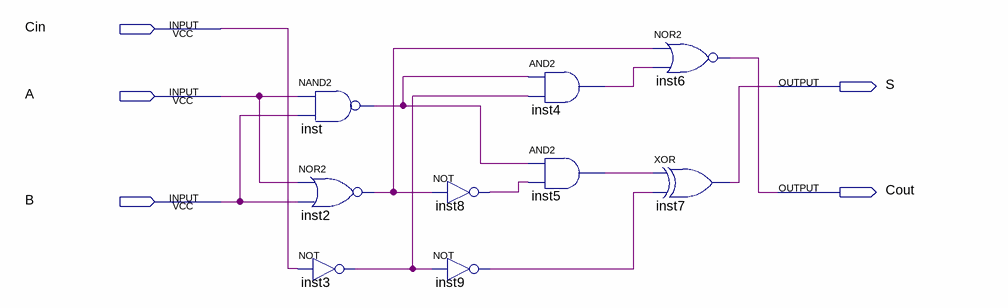
[diagram p0: schematic sheet]
// Quartus schematic SOMA_1BIT.bdf as structural Verilog: 9 symbols, 5 pins
module SOMA_1BIT (
  input  Cin,
  input  A,
  input  B,
  output S,
  output Cout
);

  wire inst2_out, inst3_out, inst4_out, inst5_out, inst8_out, inst9_out, inst_out;

  nand inst (inst_out, A, B);
  nor inst2 (inst2_out, A, B);
  not inst3 (inst3_out, Cin);
  not inst8 (inst8_out, inst2_out);
  not inst9 (inst9_out, inst3_out);
  and inst4 (inst4_out, inst_out, inst3_out);
  and inst5 (inst5_out, inst_out, inst8_out);
  nor inst6 (Cout, inst2_out, inst4_out);
  xor inst7 (S, inst5_out, inst9_out);
endmodule
